# Altium schematic sheet main.SCHDOC
size B
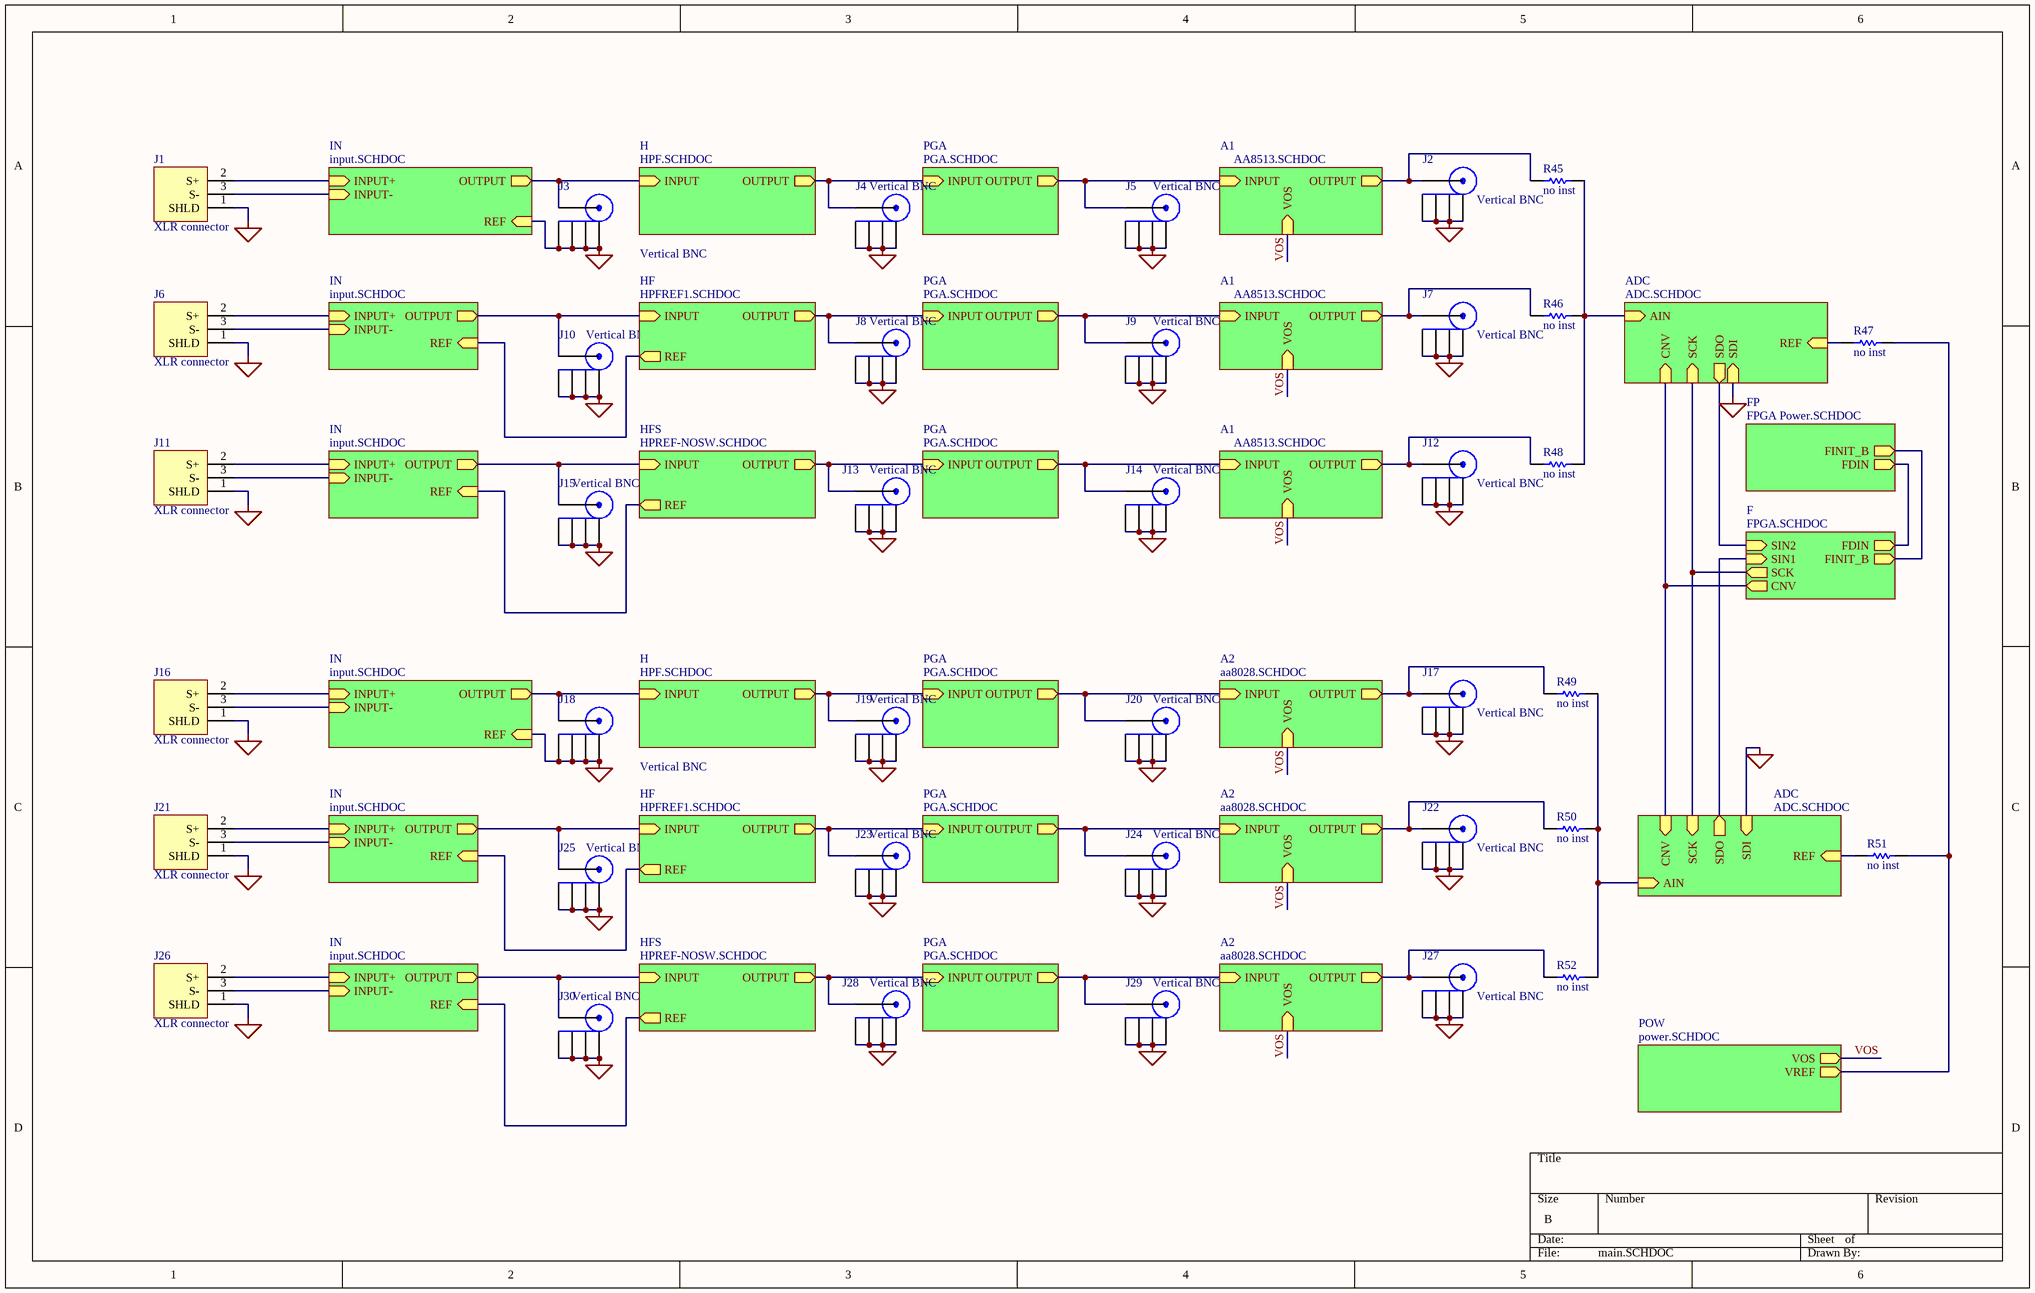
[diagram p0: main.SCHDOC]

## Parts
J1  XLR connector  [NC3FAH-0]
J2  Vertical BNC  [Vertical BNC 227699-1]
J3  Vertical BNC  [Vertical BNC 227699-1]
J4  Vertical BNC  [Vertical BNC 227699-1]
J5  Vertical BNC  [Vertical BNC 227699-1]
J6  XLR connector  [NC3FAH-0]
J7  Vertical BNC  [Vertical BNC 227699-1]
J8  Vertical BNC  [Vertical BNC 227699-1]
J9  Vertical BNC  [Vertical BNC 227699-1]
J10  Vertical BNC  [Vertical BNC 227699-1]
J11  XLR connector  [NC3FAH-0]
J12  Vertical BNC  [Vertical BNC 227699-1]
J13  Vertical BNC  [Vertical BNC 227699-1]
J14  Vertical BNC  [Vertical BNC 227699-1]
J15  Vertical BNC  [Vertical BNC 227699-1]
J16  XLR connector  [NC3FAH-0]
J17  Vertical BNC  [Vertical BNC 227699-1]
J18  Vertical BNC  [Vertical BNC 227699-1]
J19  Vertical BNC  [Vertical BNC 227699-1]
J20  Vertical BNC  [Vertical BNC 227699-1]
J21  XLR connector  [NC3FAH-0]
J22  Vertical BNC  [Vertical BNC 227699-1]
J23  Vertical BNC  [Vertical BNC 227699-1]
J24  Vertical BNC  [Vertical BNC 227699-1]
J25  Vertical BNC  [Vertical BNC 227699-1]
J26  XLR connector  [NC3FAH-0]
J27  Vertical BNC  [Vertical BNC 227699-1]
J28  Vertical BNC  [Vertical BNC 227699-1]
J29  Vertical BNC  [Vertical BNC 227699-1]
J30  Vertical BNC  [Vertical BNC 227699-1]
R45  no inst  [1206]
R46  no inst  [1206]
R47  no inst  [1206]
R48  no inst  [1206]
R49  no inst  [1206]
R50  no inst  [1206]
R51  no inst  [1206]
R52  no inst  [1206]

## Sub-sheets
A1 = AA8513.SCHDOC: OUTPUT (out), INPUT (in), VOS (in)
A1 = AA8513.SCHDOC: OUTPUT (out), INPUT (in), VOS (in)
A1 = AA8513.SCHDOC: OUTPUT (out), INPUT (in), VOS (in)
A2 = aa8028.SCHDOC: OUTPUT (out), INPUT (in), VOS (in)
A2 = aa8028.SCHDOC: OUTPUT (out), INPUT (in), VOS (in)
A2 = aa8028.SCHDOC: OUTPUT (out), INPUT (in), VOS (in)
ADC = ADC.SCHDOC: AIN (in), REF (in), SDI (in), SCK (in), SDO (out), CNV (in)
ADC = ADC.SCHDOC: AIN (in), REF (in), SDI (in), SCK (in), SDO (out), CNV (in)
F = FPGA.SCHDOC: FDIN (out), FINIT_B (out), SIN2 (in), SIN1 (in), SCK (out), CNV (out)
FP = FPGA Power.SCHDOC: FDIN (out), FINIT_B (out)
H = HPF.SCHDOC: INPUT (in), OUTPUT (out)
H = HPF.SCHDOC: INPUT (in), OUTPUT (out)
HF = HPFREF1.SCHDOC: INPUT (in), OUTPUT (out), REF (out)
HF = HPFREF1.SCHDOC: INPUT (in), OUTPUT (out), REF (out)
HFS = HPREF-NOSW.SCHDOC: INPUT (in), OUTPUT (out), REF (out)
HFS = HPREF-NOSW.SCHDOC: INPUT (in), OUTPUT (out), REF (out)
IN = input.SCHDOC: INPUT+ (in), INPUT- (in), OUTPUT (out), REF (in)
IN = input.SCHDOC: INPUT+ (in), INPUT- (in), OUTPUT (out), REF (in)
IN = input.SCHDOC: INPUT+ (in), INPUT- (in), OUTPUT (out), REF (in)
IN = input.SCHDOC: INPUT+ (in), INPUT- (in), OUTPUT (out), REF (in)
IN = input.SCHDOC: INPUT+ (in), INPUT- (in), OUTPUT (out), REF (in)
IN = input.SCHDOC: INPUT+ (in), INPUT- (in), OUTPUT (out), REF (in)
PGA = PGA.SCHDOC: OUTPUT (out), INPUT (in)
PGA = PGA.SCHDOC: OUTPUT (out), INPUT (in)
PGA = PGA.SCHDOC: OUTPUT (out), INPUT (in)
PGA = PGA.SCHDOC: OUTPUT (out), INPUT (in)
PGA = PGA.SCHDOC: OUTPUT (out), INPUT (in)
PGA = PGA.SCHDOC: OUTPUT (out), INPUT (in)
POW = power.SCHDOC: VOS (out), VREF (out)

## Nets
AGND: J1.1(SHLD) J2.2(SHLD) J2.3(SHLD) J2.4(SHLD) J2.5(SHLD) J3.2(SHLD) J3.3(SHLD) J3.4(SHLD) J3.5(SHLD) J4.2(SHLD) J4.3(SHLD) J4.4(SHLD) J4.5(SHLD) J5.2(SHLD) J5.3(SHLD) J5.4(SHLD) J5.5(SHLD) J6.1(SHLD) J7.2(SHLD) J7.3(SHLD) J7.4(SHLD) J7.5(SHLD) J8.2(SHLD) J8.3(SHLD) J8.4(SHLD) J8.5(SHLD) J9.2(SHLD) J9.3(SHLD) J9.4(SHLD) J9.5(SHLD) J10.2(SHLD) J10.3(SHLD) J10.4(SHLD) J10.5(SHLD) J11.1(SHLD) J12.2(SHLD) J12.3(SHLD) J12.4(SHLD) J12.5(SHLD) J13.2(SHLD) J13.3(SHLD) J13.4(SHLD) J13.5(SHLD) J14.2(SHLD) J14.3(SHLD) J14.4(SHLD) J14.5(SHLD) J15.2(SHLD) J15.3(SHLD) J15.4(SHLD) J15.5(SHLD) J16.1(SHLD) J17.2(SHLD) J17.3(SHLD) J17.4(SHLD) J17.5(SHLD) J18.2(SHLD) J18.3(SHLD) J18.4(SHLD) J18.5(SHLD) J19.2(SHLD) J19.3(SHLD) J19.4(SHLD) J19.5(SHLD) J20.2(SHLD) J20.3(SHLD) J20.4(SHLD) J20.5(SHLD) J21.1(SHLD) J22.2(SHLD) J22.3(SHLD) J22.4(SHLD) J22.5(SHLD) J23.2(SHLD) J23.3(SHLD) J23.4(SHLD) J23.5(SHLD) J24.2(SHLD) J24.3(SHLD) J24.4(SHLD) J24.5(SHLD) J25.2(SHLD) J25.3(SHLD) J25.4(SHLD) J25.5(SHLD) J26.1(SHLD) J27.2(SHLD) J27.3(SHLD) J27.4(SHLD) J27.5(SHLD) J28.2(SHLD) J28.3(SHLD) J28.4(SHLD) J28.5(SHLD) J29.2(SHLD) J29.3(SHLD) J29.4(SHLD) J29.5(SHLD) J30.2(SHLD) J30.3(SHLD) J30.4(SHLD) J30.5(SHLD) ; sheet IN/REF, sheet IN/REF, sheet ADC/SDI, sheet ADC/SDI
VOS: sheet A1/VOS, sheet A1/VOS, sheet A1/VOS, sheet A2/VOS, sheet A2/VOS, sheet A2/VOS, sheet POW/VOS
NetJ1_2: J1.2(S+) ; sheet IN/INPUT+
NetJ1_3: J1.3(S-) ; sheet IN/INPUT-
NetJ2_1: J2.1(PIN) R45.1 ; sheet A1/OUTPUT
NetJ3_1: J3.1(PIN) ; sheet IN/OUTPUT, sheet H/INPUT
NetJ4_1: J4.1(PIN) ; sheet H/OUTPUT, sheet PGA/INPUT
NetJ5_1: J5.1(PIN) ; sheet PGA/OUTPUT, sheet A1/INPUT
NetJ6_2: J6.2(S+) ; sheet IN/INPUT+
NetJ6_3: J6.3(S-) ; sheet IN/INPUT-
NetJ7_1: J7.1(PIN) R46.1 ; sheet A1/OUTPUT
NetJ8_1: J8.1(PIN) ; sheet HF/OUTPUT, sheet PGA/INPUT
NetJ9_1: J9.1(PIN) ; sheet A1/INPUT, sheet PGA/OUTPUT
NetJ10_1: J10.1(PIN) ; sheet IN/OUTPUT, sheet HF/INPUT
NetJ11_2: J11.2(S+) ; sheet IN/INPUT+
NetJ11_3: J11.3(S-) ; sheet IN/INPUT-
NetJ12_1: J12.1(PIN) R48.1 ; sheet A1/OUTPUT
NetJ13_1: J13.1(PIN) ; sheet PGA/INPUT, sheet HFS/OUTPUT
NetJ14_1: J14.1(PIN) ; sheet PGA/OUTPUT, sheet A1/INPUT
NetJ15_1: J15.1(PIN) ; sheet IN/OUTPUT, sheet HFS/INPUT
NetJ16_2: J16.2(S+) ; sheet IN/INPUT+
NetJ16_3: J16.3(S-) ; sheet IN/INPUT-
NetJ17_1: J17.1(PIN) R49.1 ; sheet A2/OUTPUT
NetJ18_1: J18.1(PIN) ; sheet IN/OUTPUT, sheet H/INPUT
NetJ19_1: J19.1(PIN) ; sheet H/OUTPUT, sheet PGA/INPUT
NetJ20_1: J20.1(PIN) ; sheet PGA/OUTPUT, sheet A2/INPUT
NetJ21_2: J21.2(S+) ; sheet IN/INPUT+
NetJ21_3: J21.3(S-) ; sheet IN/INPUT-
NetJ22_1: J22.1(PIN) R50.1 ; sheet A2/OUTPUT
NetJ23_1: J23.1(PIN) ; sheet HF/OUTPUT, sheet PGA/INPUT
NetJ24_1: J24.1(PIN) ; sheet PGA/OUTPUT, sheet A2/INPUT
NetJ25_1: J25.1(PIN) ; sheet IN/OUTPUT, sheet HF/INPUT
NetJ26_2: J26.2(S+) ; sheet IN/INPUT+
NetJ26_3: J26.3(S-) ; sheet IN/INPUT-
NetJ27_1: J27.1(PIN) R52.1 ; sheet A2/OUTPUT
NetJ28_1: J28.1(PIN) ; sheet PGA/INPUT, sheet HFS/OUTPUT
NetJ29_1: J29.1(PIN) ; sheet PGA/OUTPUT, sheet A2/INPUT
NetJ30_1: J30.1(PIN) ; sheet IN/OUTPUT, sheet HFS/INPUT
NetR45_2: R45.2 R46.2 R48.2 ; sheet ADC/AIN
NetR47_1: R47.1 ; sheet ADC/REF
NetR47_2: R47.2 R51.2 ; sheet POW/VREF
NetR49_2: R49.2 R50.2 R52.2 ; sheet ADC/AIN
NetR51_1: R51.1 ; sheet ADC/REF
(unnamed): sheet IN/REF, sheet HF/REF
(unnamed): sheet IN/REF, sheet HFS/REF
(unnamed): sheet IN/REF, sheet HF/REF
(unnamed): sheet IN/REF, sheet HFS/REF
(unnamed): sheet ADC/SCK, sheet ADC/SCK, sheet F/SCK
(unnamed): sheet ADC/SDO, sheet F/SIN2
(unnamed): sheet ADC/CNV, sheet ADC/CNV, sheet F/CNV
(unnamed): sheet ADC/SDO, sheet F/SIN1
(unnamed): sheet F/FDIN, sheet FP/FDIN
(unnamed): sheet F/FINIT_B, sheet FP/FINIT_B

## Library data of the parts
J1 J6 J11 J16 J21 J26 = XLR: XLR balanced connector, standard
J2-J5 J7-J10 J12-J15 J17-J20 J22-J25 J27-J30 = VERTBNC: Vertical BNC with correct grounding pin behavior
R45-R52 = Res1: Resistor; Value: 0; Published: 8-Jun-2000; LatestRevisionDate: 17-Jul-2002; LatestRevisionNote: Re-released for DXP Platform.; Publisher: Altium Limited